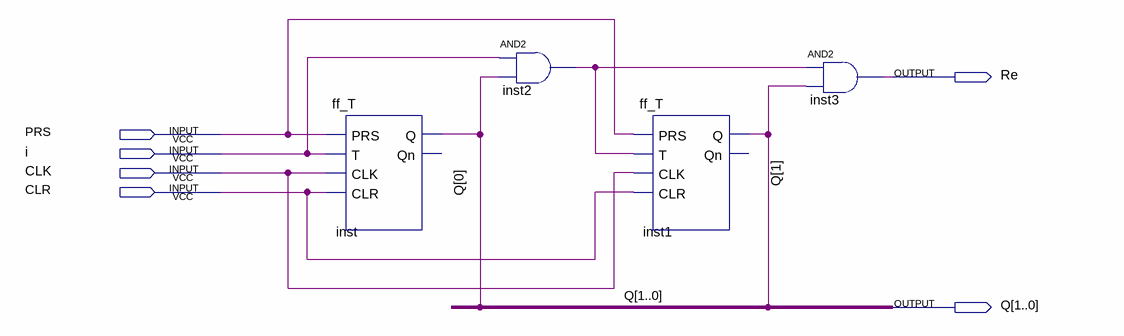
[diagram p0: schematic sheet]
// Quartus schematic the2bits_counter_d4.bdf as structural Verilog: 4 symbols, 6 pins
module the2bits_counter_d4 (
  input  PRS,
  input  i,
  input  CLK,
  input  CLR,
  output Re,
  output [1:0] Q
);

  wire inst2_out;

  ff_T inst (.PRS(PRS), .T(i), .CLK(CLK), .CLR(CLR), .Q(Q[0]));  // open: Qn
  and inst2 (inst2_out, i, Q[0]);
  ff_T inst1 (.PRS(PRS), .T(inst2_out), .CLK(CLK), .CLR(CLR), .Q(Q[1]));  // open: Qn
  and inst3 (Re, inst2_out, Q[1]);
endmodule
